# Altium schematic sheet Filter Capacitors - Port K.SchDoc: PORT K Filter Capacitors
size A4; DocumentNumber: 31; SheetNumber: 31; SheetTotal: 54
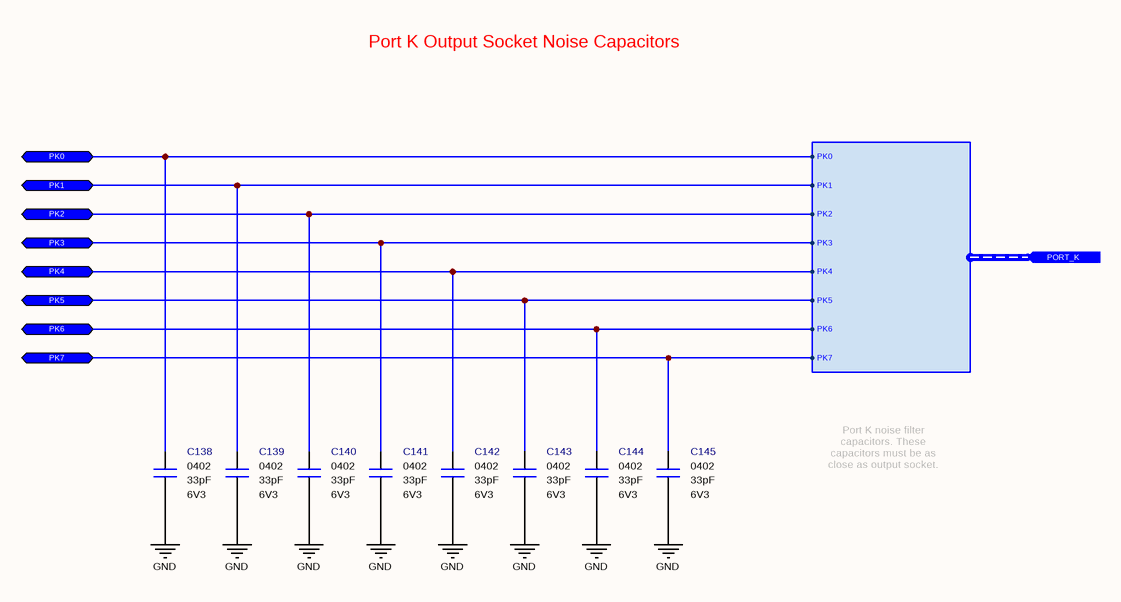
[diagram p0: Filter Capacitors - Port K.SchDoc]

## Parts
C138  value 33pF  Case: 0402  Voltage: 6V3  [CAPACITOR_0402]  (hidden comment: Multilayer Ceramic Capacitor)
C139  value 33pF  Case: 0402  Voltage: 6V3  [CAPACITOR_0402]  (hidden comment: Multilayer Ceramic Capacitor)
C140  value 33pF  Case: 0402  Voltage: 6V3  [CAPACITOR_0402]  (hidden comment: Multilayer Ceramic Capacitor)
C141  value 33pF  Case: 0402  Voltage: 6V3  [CAPACITOR_0402]  (hidden comment: Multilayer Ceramic Capacitor)
C142  value 33pF  Case: 0402  Voltage: 6V3  [CAPACITOR_0402]  (hidden comment: Multilayer Ceramic Capacitor)
C143  value 33pF  Case: 0402  Voltage: 6V3  [CAPACITOR_0402]  (hidden comment: Multilayer Ceramic Capacitor)
C144  value 33pF  Case: 0402  Voltage: 6V3  [CAPACITOR_0402]  (hidden comment: Multilayer Ceramic Capacitor)
C145  value 33pF  Case: 0402  Voltage: 6V3  [CAPACITOR_0402]  (hidden comment: Multilayer Ceramic Capacitor)

## Ports
PK0 (bidir), PK1 (bidir), PK2 (bidir), PK3 (bidir), PK4 (bidir), PK5 (bidir), PK6 (bidir), PK7 (bidir), PORT_K (in, harness PORT_K)

## Harnesses
PORT_K: PK0, PK1, PK2, PK3, PK4, PK5, PK7, PK6

## Nets
GND: C138.1 C139.1 C140.1 C141.1 C142.1 C143.1 C144.1 C145.1
PK0: C138.2 ; port PK0, port PORT_K.PK0
PK1: C139.2 ; port PK1, port PORT_K.PK1
PK2: C140.2 ; port PK2, port PORT_K.PK2
PK3: C141.2 ; port PK3, port PORT_K.PK3
PK4: C142.2 ; port PK4, port PORT_K.PK4
PK5: C143.2 ; port PK5, port PORT_K.PK5
PK6: C144.2 ; port PK6, port PORT_K.PK6
PK7: C145.2 ; port PK7, port PORT_K.PK7

## Notes on the sheet
- Port K Output Socket Noise Capacitors
- Port K noise filter capacitors. These capacitors must be as close as output socket.
- Title
- Size:
- Date:
- A4
- Number:
- Time:
- Revision:
- Sheet
- of
- File:

## Library data of the parts
C138-C145 = Capacitor - 33pF [0402-6V3]: Capacitor - 33pF [0402] (Ceramic); Manufacturer Name: Kemet; Manufacturer Part Number: C0402C330J9RACAUTO; Dielectric: X7R; Tolerance: 10%; Height: 0.5mm; Maximum Operating Temperature: +125; Minimum Operating Temperature: -55; ROHS: Yes; ComponentLink1Description: DataSheet; ComponentLink1URL: https://api.kemet.com/component-edge/download/datasheet/C0402C330J9RACAUTO.pdf; ComponentLink2Description: Mouser; ComponentLink2URL: https://www.mouser.com/Search/Refine.aspx?Keyword=80-C0402C330J9RAUTO; Supplier 1: Mouser; Supplier Part Number 1: 80-C0402C330J9RAUTO; Mouser Part Number: 80-C0402C330J9RAUTO